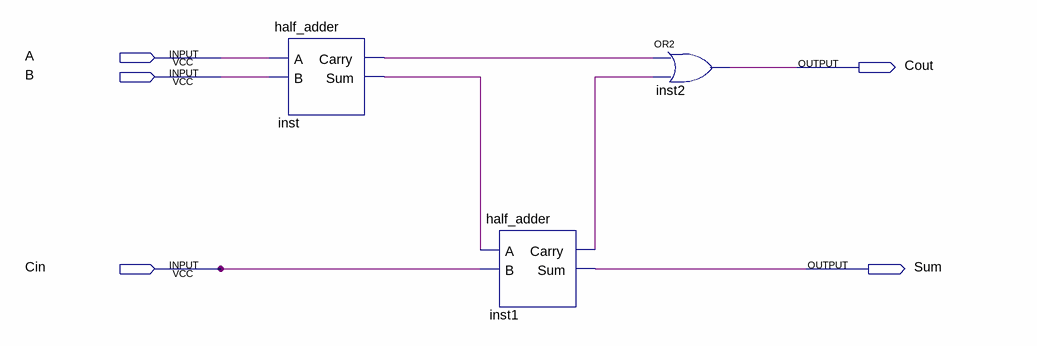
[diagram p0: schematic sheet]
// Quartus schematic full_adder.bdf as structural Verilog: 3 symbols, 5 pins
module full_adder (
  input  A,
  input  B,
  input  Cin,
  output Cout,
  output Sum
);

  wire inst1_carry, inst_carry, inst_sum;

  half_adder inst (.A(A), .B(B), .Carry(inst_carry), .Sum(inst_sum));
  half_adder inst1 (.A(inst_sum), .B(Cin), .Carry(inst1_carry), .Sum(Sum));
  or inst2 (Cout, inst_carry, inst1_carry);
endmodule
